# EAGLE schematic Controller (EAGLE 9.6.1)
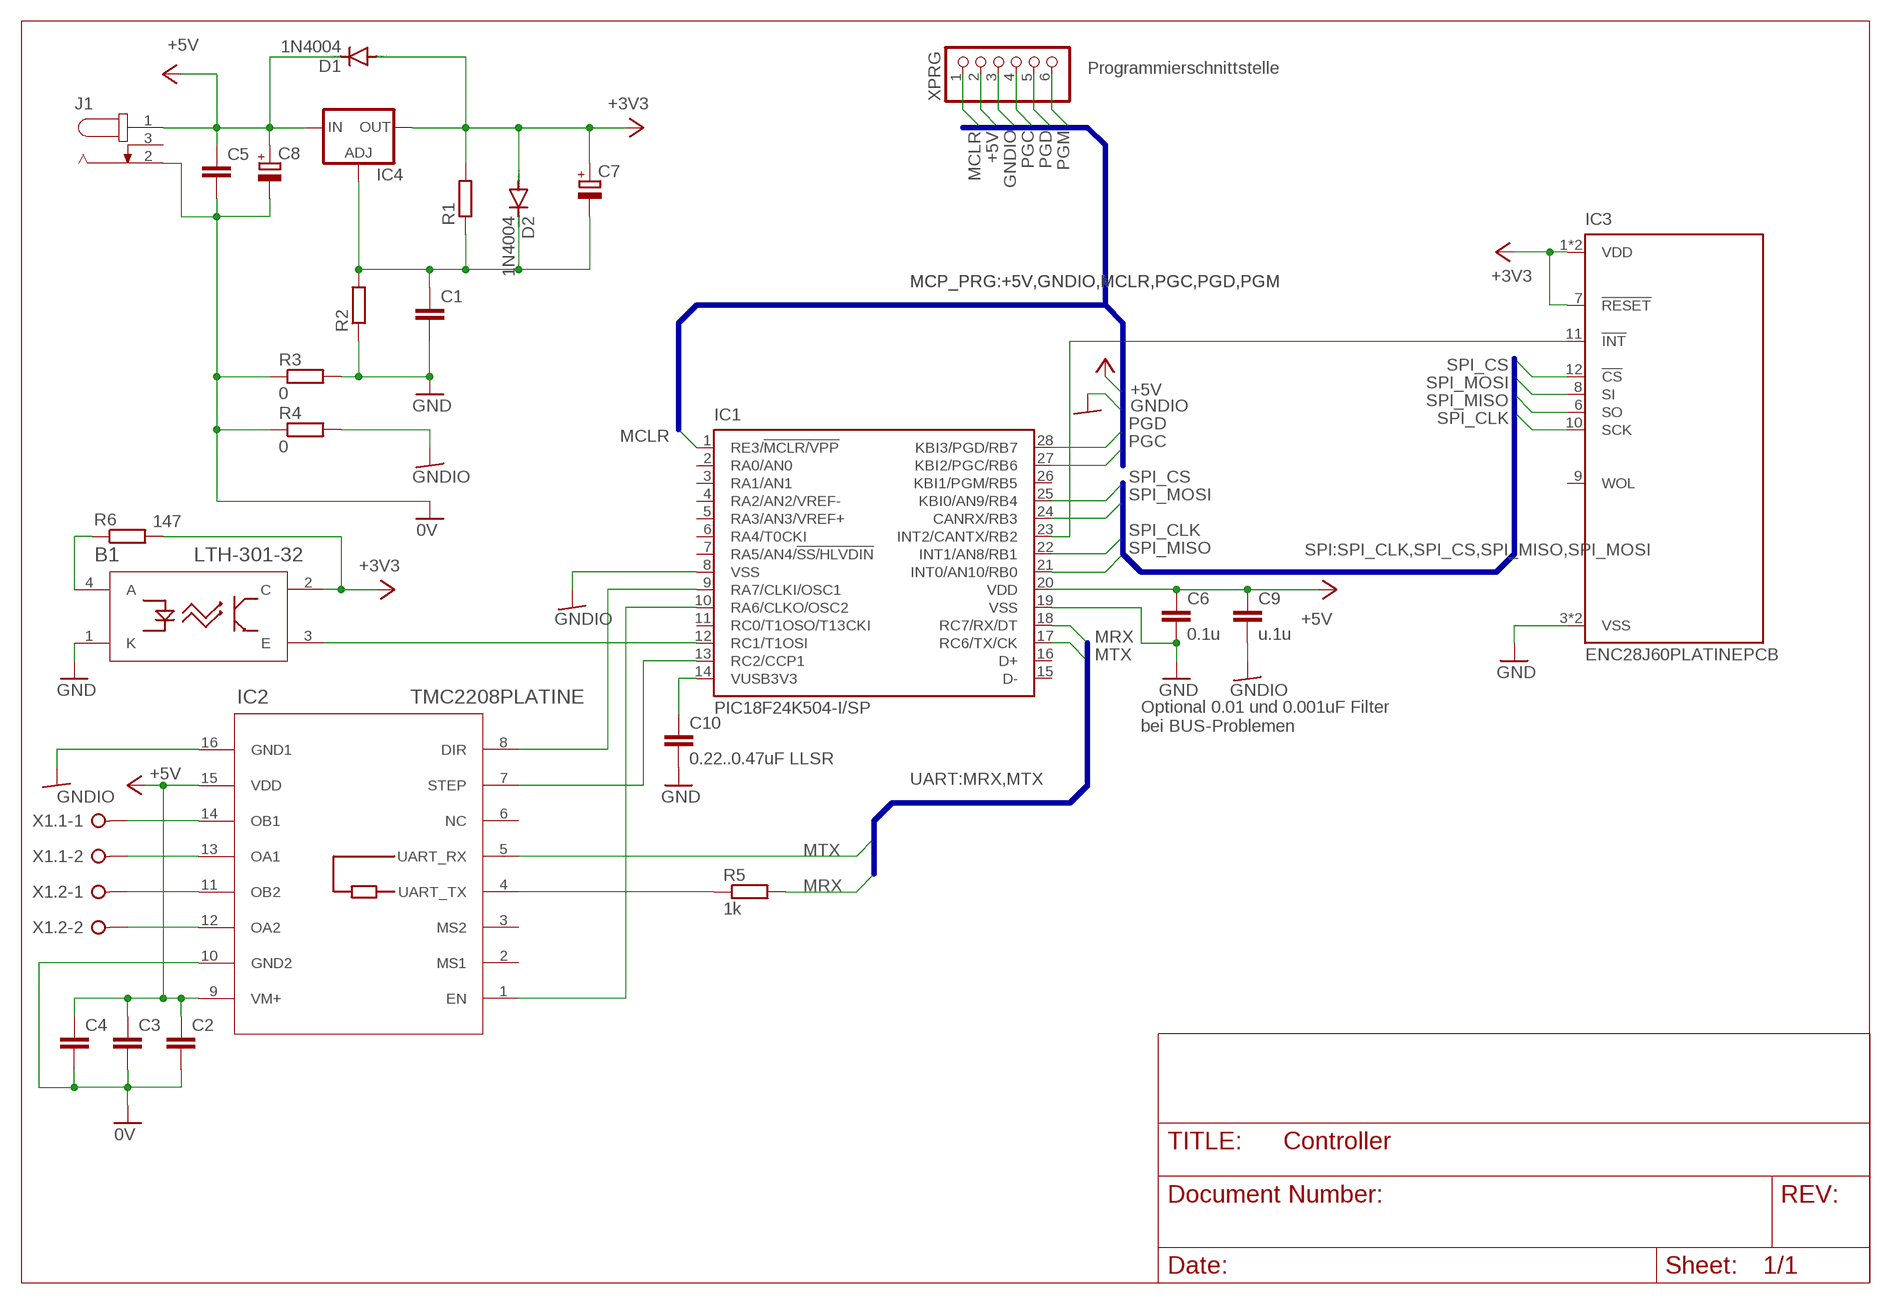
[diagram p0: schematic, sheet 1]

## Parts
B1  LTH-301-32  [LTH-301-32_LTO]
C1  C-EU025_050-025X075  [C025_050-025X075]
C2  C-EU025_050-025X075  [C025_050-025X075]
C3  C-EU025_050-025X075  [C025_050-025X075]
C4  C-EU025_050-025X075  [C025_050-025X075]
C5  C-EU025_050-025X075  [C025_050-025X075]
C6  0.1u  C-EU025_050-025X075  [C025_050-025X075]
C7  CPOL-EUE2.5-6  [E2,5-6]
C8  CPOL-EUE2.5-6  [E2,5-6]
C9  u.1u  C-EU025_050-025X075  [C025_050-025X075]
C10  0.22..0.47uF LLSR  C-EU025_050-025X075  [C025_050-025X075]
D1  1N4004  [DO41-10]
D2  1N4004  [DO41-10]
IC1  PIC18F24K504-I/SP  [DIL28-3]
IC2  TMC2208PLATINE  [2X08_TMCBOARD]
IC3  ENC28J60PLATINEPCB  [ENCPLATINE]
IC4  LM317TO220  [317TL]
J1  JACK-PLUG2,5  [SPC4078]
R1  R-EU_0207/10  [0207/10]
R2  R-EU_0207/10  [0207/10]
R3  0  R-EU_R0603  [R0603]
R4  0  R-EU_R0603  [R0603]
R5  1k  R-EU_R0603  [R0603]
R6  147  R-EU_0207/10  [0207/10]
X1.1  W237-02P  [W237-132]
X1.2  W237-02P  [W237-132]
XPRG  PINHD-1X6/90  [1X06/90]

## Nets
0V: C2.2 C3.2 C4.2 C5.2 C8.- IC2.10(GND2) J1.2 R3.1 R4.1
+3V3: B1.2(C) C7.+ D1.A D2.A IC3.1(VDD) IC3.2(VDD) IC3.7(!RESET) IC4.2(OUT) R1.2 R6.2
+5V: C2.1 C3.1 C4.1 C5.1 C6.1 C8.+ C9.1 D1.C IC1.20(VDD) IC2.9(VM+) IC2.15(VDD) IC4.3(IN) J1.1 XPRG.2
GND: B1.1(K) C1.2 C6.2 C10.2 IC1.19(VSS) IC3.3(VSS) IC3.4(VSS) R2.1 R3.2
GNDIO: C9.2 IC1.8(VSS) IC2.16(GND1) R4.2 XPRG.3
MCLR: IC1.1(RE3/!MCLR/VPP) XPRG.1
MRX: IC1.18(RC7/RX/DT) R5.2
MTX: IC1.17(RC6/TX/CK) IC2.5(UART_RX)
N$1: IC2.4(UART_TX) R5.1
N$2: IC1.13(RC2/CCP1) IC2.7(STEP)
N$3: C1.1 C7.- D2.C IC4.1(ADJ) R1.1 R2.2
N$4: IC2.14(OB1) X1.1.1
N$5: IC1.23(INT2/CANTX/RB2) IC3.11(!INT)
N$6: IC1.10(RA6/CLKO/OSC2) IC2.1(EN)
N$7: IC1.9(RA7/CLKI/OSC1) IC2.8(DIR)
N$8: IC2.13(OA1) X1.1.2
N$9: IC2.11(OB2) X1.2.1
N$10: IC2.12(OA2) X1.2.2
N$13: C10.1 IC1.14(VUSB3V3)
N$14: B1.3(E) IC1.12(RC1/T1OSI)
N$15: B1.4(A) R6.1
PGC: IC1.27(KBI2/PGC/RB6) XPRG.4
PGD: IC1.28(KBI3/PGD/RB7) XPRG.5
PGM: XPRG.6
SPI_CLK: IC1.22(INT1/AN8/RB1) IC3.10(SCK)
SPI_CS: IC1.25(KBI0/AN9/RB4) IC3.12(!CS)
SPI_MISO: IC1.21(INT0/AN10/RB0) IC3.6(SO)
SPI_MOSI: IC1.24(CANRX/RB3) IC3.8(SI)
Unconnected: IC1.2(RA0/AN0) IC1.3(RA1/AN1) IC1.4(RA2/AN2/VREF-) IC1.5(RA3/AN3/VREF+) IC1.6(RA4/T0CKI) IC1.7(RA5/AN4/!SS/HLVDIN) IC1.11(RC0/T1OSO/T13CKI) IC1.15(D-) IC1.16(D+) IC1.26(KBI1/PGM/RB5) IC2.2(MS1) IC2.3(MS2) IC2.6(NC) IC3.9(WOL) J1.3

## Buses
SPI:SPI_CLK,SPI_CS,SPI_MISO,SPI_MOSI
UART:MRX,MTX
MCP_PRG:+5V,GNDIO,MCLR,PGC,PGD,PGM

## Notes on the sheet
- Programmierschnittstelle
- Optional 0.01 und 0.001uF Filter 
  bei BUS-Problemen

## Library data of the parts
B1 = ROSnode:LTH-301-32; COPYRIGHT: Copyright (C) 2018 Accelerated Designs. All rights reserved; MF: Lite-On; MPN: LTH-301-32; SOURCELIBRARY: Lite-On_2019-12-03
C1-C6 C9 C10 = rcl:C-EU: CAPACITOR, European symbol; SPICEPREFIX: C
C7 C8 = rcl:CPOL-EU: POLARIZED CAPACITOR, European symbol; SPICEPREFIX: C
D1 D2 = diode:1N4004: DIODE general purpose rectifier, 1 A
IC1 = ROSnode:PIC18F24K50: 28-Pin Enhanced Flash Microcontrollers; MF: MICROCHIP; MPN: PIC18F24K50-I/SP
IC2 = ROSnode:TMC2208PLATINE: PCB Version für MKS Drucker; MF: TRINAMICS; MFN: TMC2208
IC3 = ROSnode:ENC28J60PLATINE; MF: -; MFN: ENC28J60 Netzwerkmodul
IC4 = ROSnode:LM317: VOLTAGE REGULATOR; MF: STM; MPN: LM317
J1 = ROSnode:JACK-PLUG: DC POWER JACK Power Jack, DC, Right Angle, Through Hole, Rated 5A at 16VDC, PC Terminals
R1-R6 = rcl:R-EU_: RESISTOR, European symbol; SPICEPREFIX: R
X1.1 X1.2 = ROSnode:W237-02P: WAGO SREW CLAMP; OC_FARNELL: unknown; OC_NEWARK: unknown
XPRG = ROSnode:PINHD-1X6: PIN HEADER